# Altium schematic sheet Sensors.SchDoc
size A4
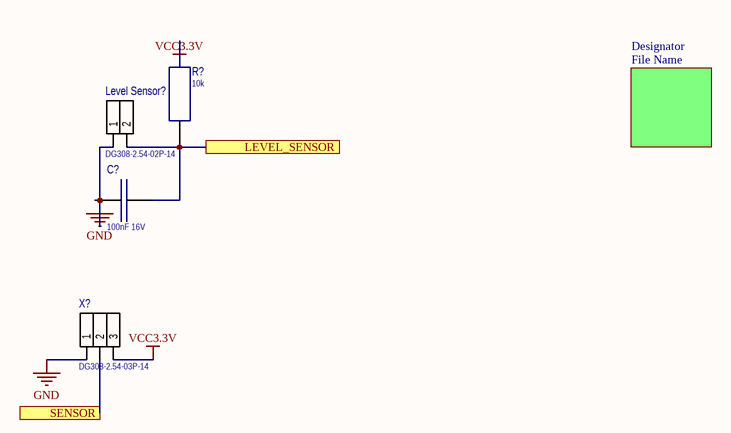
[diagram p0: Sensors.SchDoc]

## Parts
C?  100nF 16V  [C_0805]
Level_Sensor?  DG308-2.54-02P-14  [DG308-2.54-02P-14]
R?  10k  [R_0805]
X?  DG308-2.54-03P-14  [DG308-2.54-03P-14]

## Sub-sheets
Designator = File Name: no entries

## Ports
LEVEL_SENSOR, SENSOR

## Nets
GND: C?.1 Level_Sensor?.1 X?.1
VCC3.3V: R?.2 X?.3
LEVEL_SENSOR: C?.2 Level_Sensor?.2 R?.1 ; port LEVEL_SENSOR
SENSOR: X?.2 ; port SENSOR

## Library data of the parts
C? = C0805: Capacitor; Value: 100nF 16V
Level_Sensor? = DG308-2.54-02P-14: Connector 3Pin 2.54 pitch
R? = R0805: Resistor; Value: 10k
X? = DG308-2.54-03P-14: Connector 3Pin 2.54 pitch